# Altium project MIcrocontroller_Fit.PrjPcb
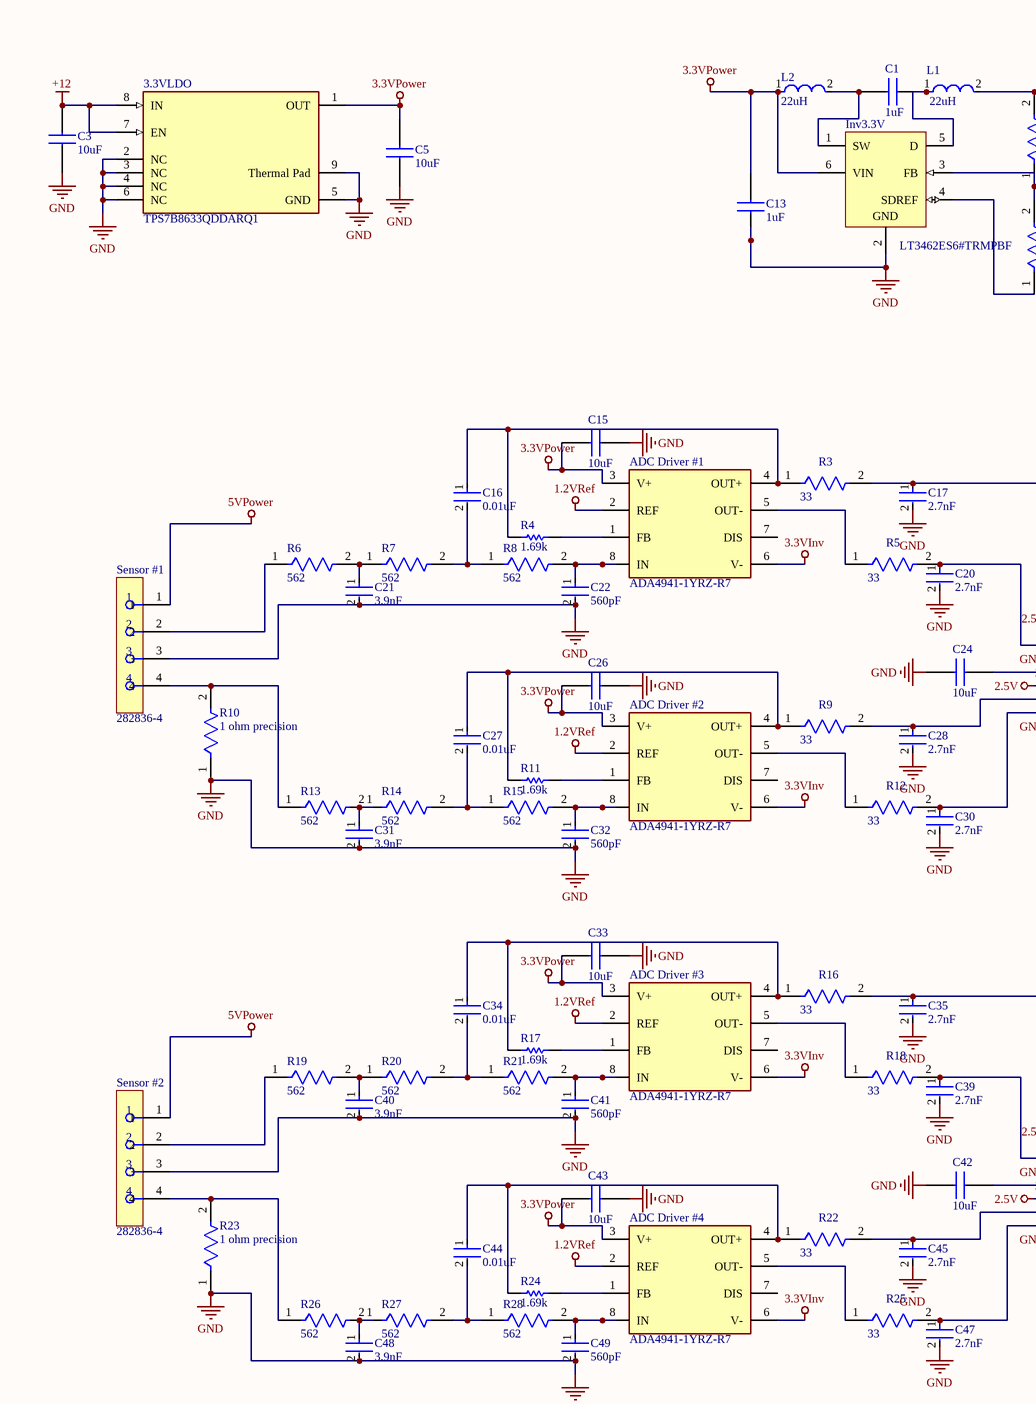
[diagram p0: Sheet1.SchDoc, top left]
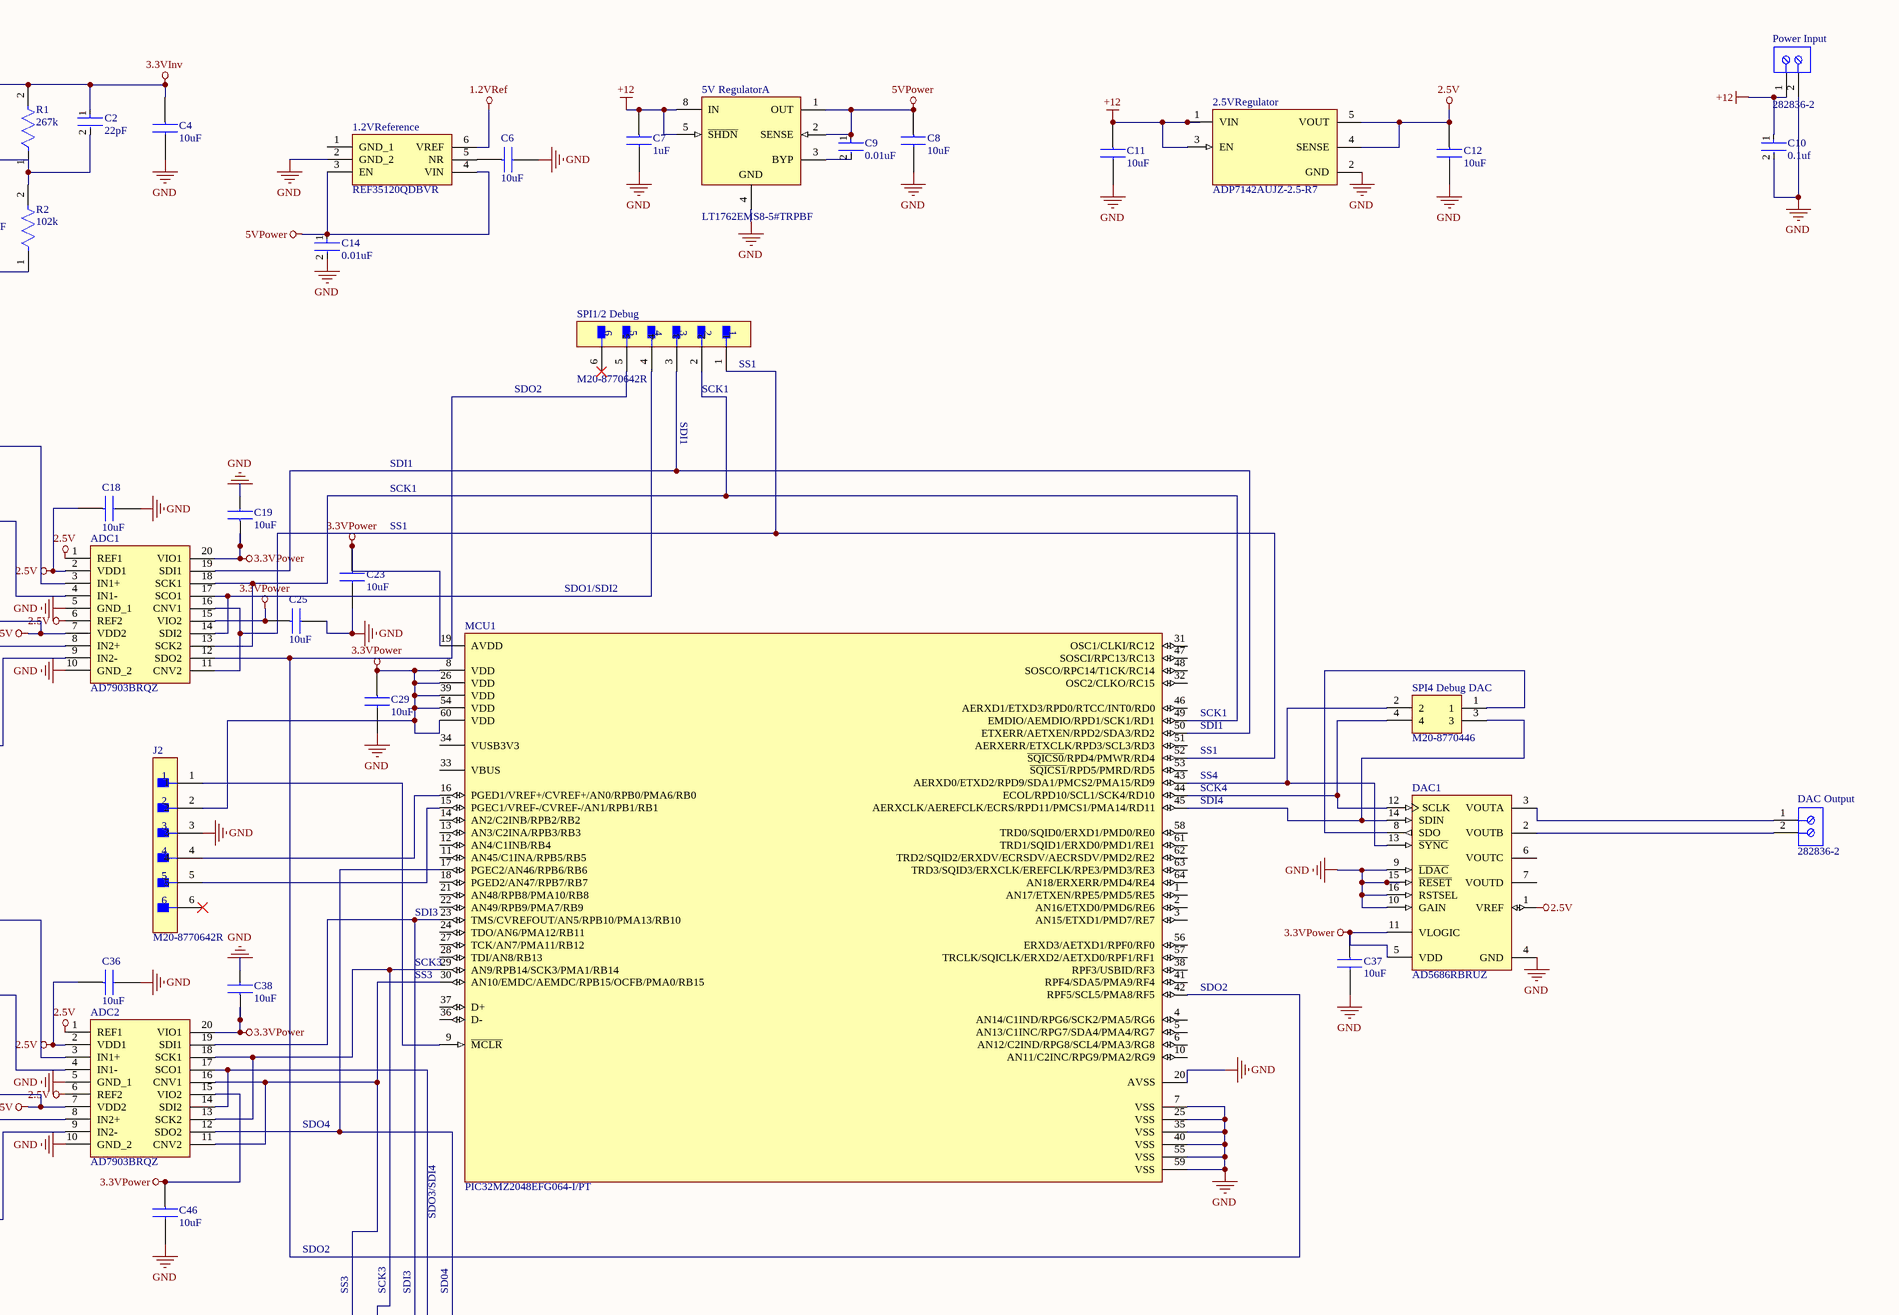
[diagram p1: Sheet1.SchDoc, top right]
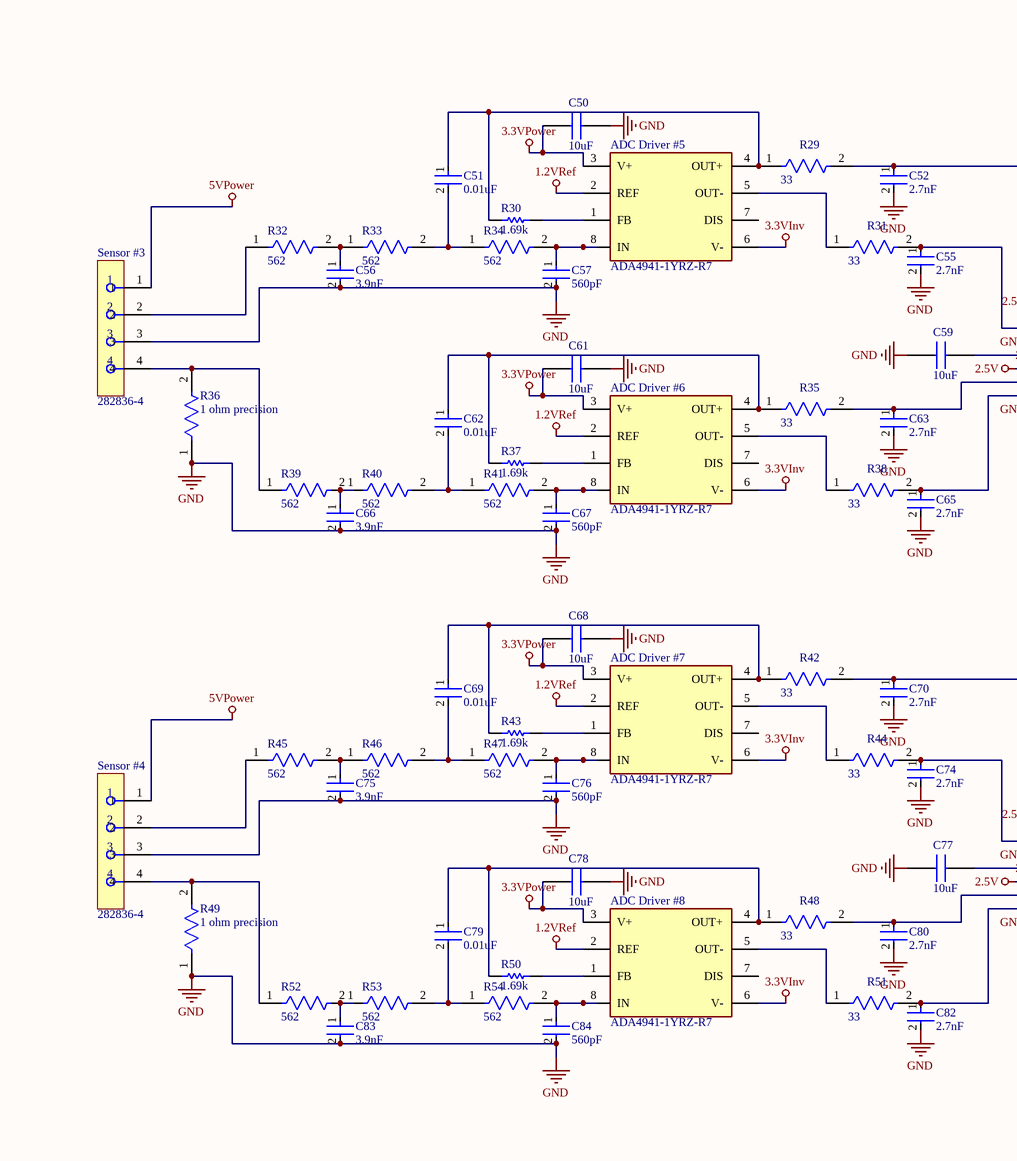
[diagram p2: Sheet1.SchDoc, bottom left]
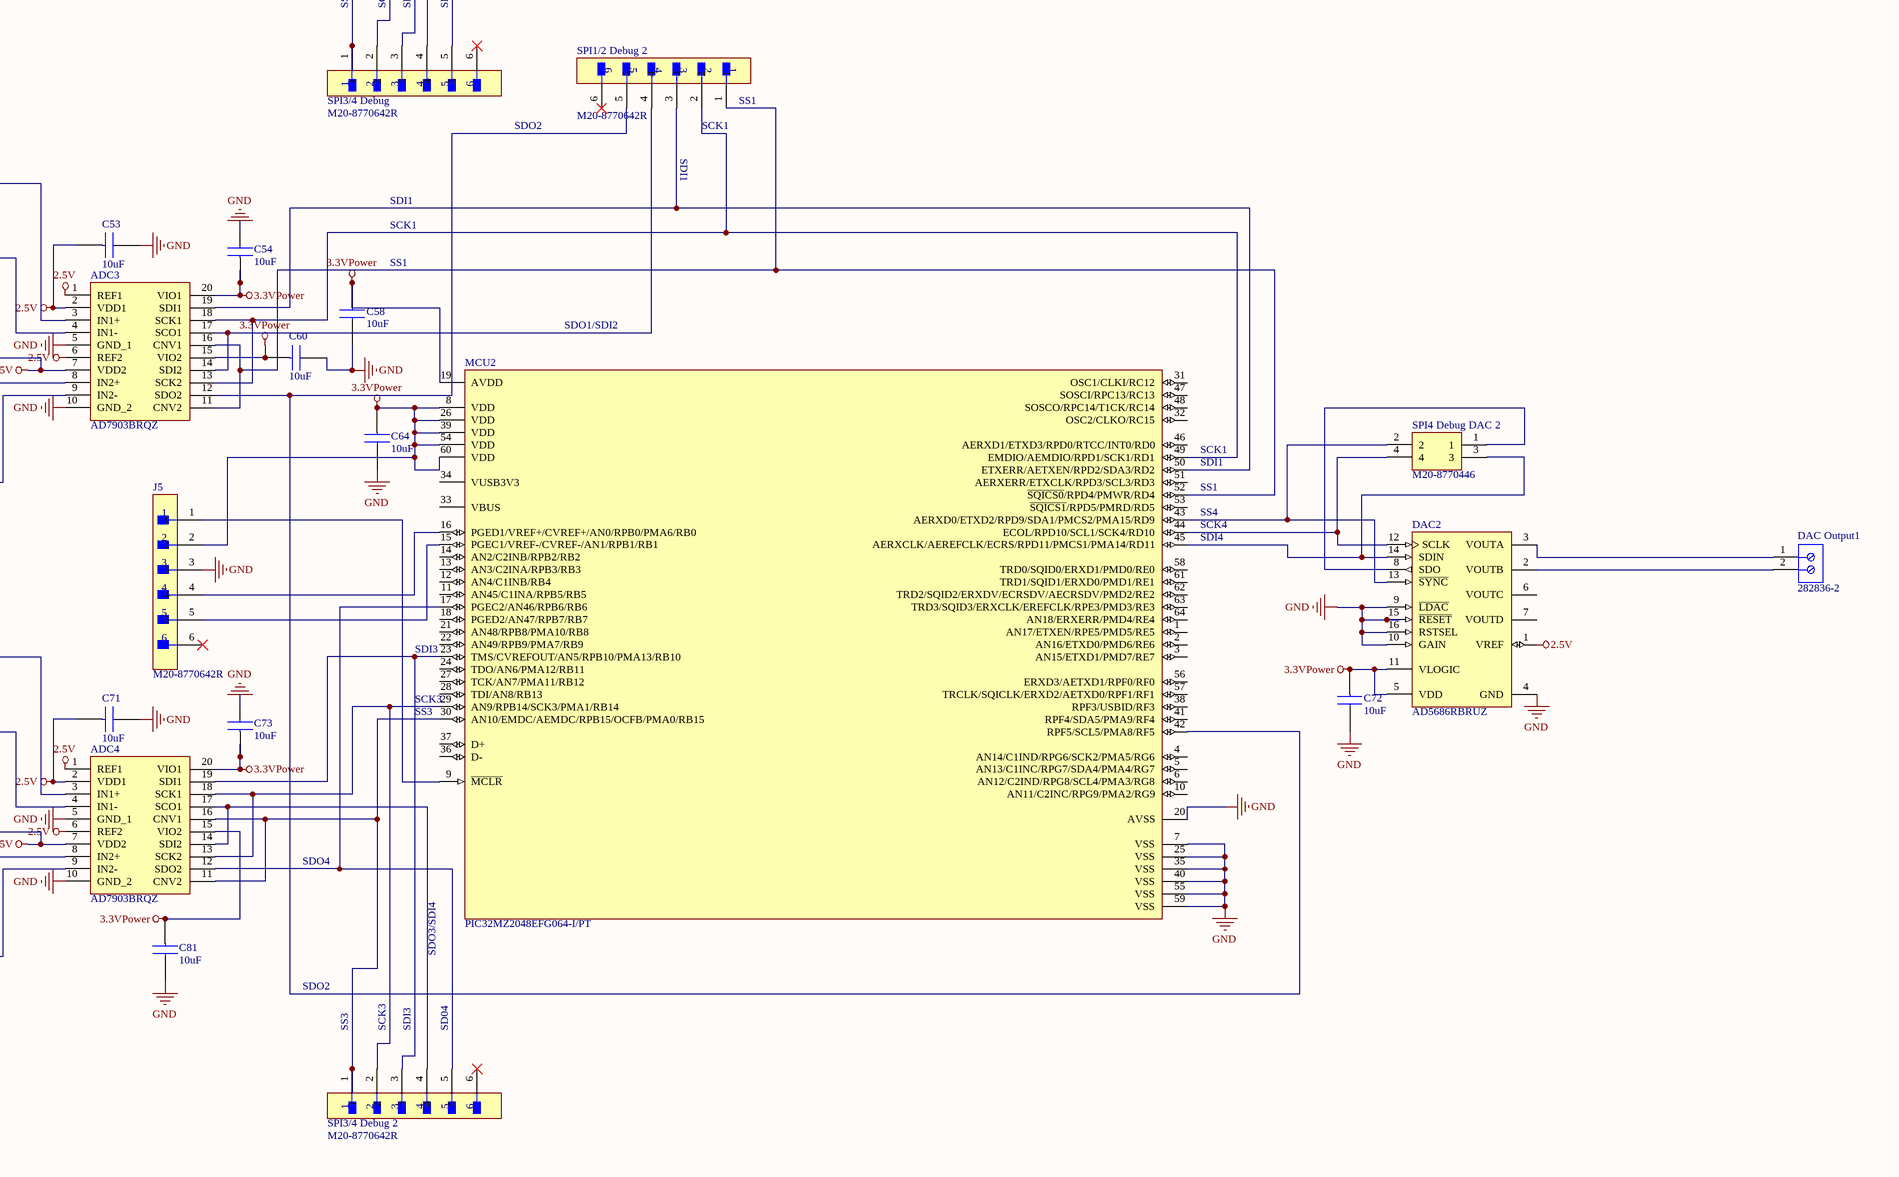
[diagram p3: Sheet1.SchDoc, bottom right]
1 sheet, 176 parts. Net scope: global (net labels, ports and power ports of the same name join across sheets).
Board file: PCB2.PcbDoc

## Sheet Sheet1.SchDoc
size 635 x 508 mm; SheetNumber: 1; SheetTotal: 1

### Parts
1.2VReference  REF35120QDBVR  [SOT95P280X145-6N]
2.5VRegulator  ADP7142AUJZ-2.5-R7  [FP-UJ-5-IPC_B]
3.3VLDO  TPS7B8633QDDARQ1  [FP-DDA0008B-MFG]
5V_Regulator  LT1762EMS8-5#TRPBF  [LT-MS8_L]  (part A of 2)
ADC1  AD7903BRQZ  [SOP64P600X175-20N]
ADC2  AD7903BRQZ  [RQ_20_ADI]
ADC3  AD7903BRQZ  [SOP64P600X175-20N]
ADC4  AD7903BRQZ  [SOP64P600X175-20N]
ADC_Driver_#1  ADA4941-1YRZ-R7  [FP-R-8-IPC_B]
ADC_Driver_#2  ADA4941-1YRZ-R7  [FP-R-8-IPC_B]
ADC_Driver_#3  ADA4941-1YRZ-R7  [FP-R-8-IPC_B]
ADC_Driver_#4  ADA4941-1YRZ-R7  [FP-R-8-IPC_B]
ADC_Driver_#5  ADA4941-1YRZ-R7  [FP-R-8-IPC_B]
ADC_Driver_#6  ADA4941-1YRZ-R7  [FP-R-8-IPC_B]
ADC_Driver_#7  ADA4941-1YRZ-R7  [FP-R-8-IPC_B]
ADC_Driver_#8  ADA4941-1YRZ-R7  [FP-R-8-IPC_B]
C1  1uF  [CAPC3216X178N]
C2  22pF  [FP-C1206C-EB-MFG]
C3  10uF  [CAPC3216X229N]
C4  10uF  [CAPC3216X229N]
C5  10uF  [CAPC3216X229N]
C6  10uF  [CAPC3216X229N]
C7  1uF  [CAPC3216X178N]
C8  10uF  [CAPC3216X229N]
C9  0.01uF  [FP-C0603C-CF-MFG]
C10  0.1uf  [FP-C0603C-CF-MFG]
C11  10uF  [CAPC3216X229N]
C12  10uF  [CAPC3216X229N]
C13  1uF  [CAPC3216X178N]
C14  0.01uF  [FP-C0603C-CF-MFG]
C15  10uF  [CAPC3216X229N]
C16  0.01uF  [FP-C0603C-CF-MFG]
C17  2.7nF  [FP-1206-L_3_2_0_2-W_1_6_0-IPC_A]
C18  10uF  [CAPC3216X229N]
C19  10uF  [CAPC3216X229N]
C20  2.7nF  [FP-1206-L_3_2_0_2-W_1_6_0-IPC_A]
C21  3.9nF  [FP-C1206C-EB-MFG]
C22  560pF  [FP-GCM31B-0_2-IPC_C]
C23  10uF  [CAPC3216X229N]
C24  10uF  [CAPC3216X229N]
C25  10uF  [CAPC3216X229N]
C26  10uF  [CAPC3216X229N]
C27  0.01uF  [FP-C0603C-CF-MFG]
C28  2.7nF  [FP-1206-L_3_2_0_2-W_1_6_0-IPC_A]
C29  10uF  [CAPC3216X229N]
C30  2.7nF  [FP-1206-L_3_2_0_2-W_1_6_0-IPC_A]
C31  3.9nF  [FP-C1206C-EB-MFG]
C32  560pF  [FP-GCM31B-0_2-IPC_C]
C33  10uF  [CAPC3216X229N]
C34  0.01uF  [FP-C0603C-CF-MFG]
C35  2.7nF  [FP-1206-L_3_2_0_2-W_1_6_0-IPC_A]
C36  10uF  [CAPC3216X229N]
C37  10uF  [CAPC3216X229N]
C38  10uF  [CAPC3216X229N]
C39  2.7nF  [FP-1206-L_3_2_0_2-W_1_6_0-IPC_A]
C40  3.9nF  [FP-C1206C-EB-MFG]
C41  560pF  [FP-GCM31B-0_2-IPC_C]
C42  10uF  [CAPC3216X229N]
C43  10uF  [CAPC3216X229N]
C44  0.01uF  [FP-C0603C-CF-MFG]
C45  2.7nF  [FP-1206-L_3_2_0_2-W_1_6_0-IPC_A]
C46  10uF  [CAPC3216X229N]
C47  2.7nF  [FP-1206-L_3_2_0_2-W_1_6_0-IPC_A]
C48  3.9nF  [FP-C1206C-EB-MFG]
C49  560pF  [FP-GCM31B-0_2-IPC_C]
C50  10uF  [CAPC3216X229N]
C51  0.01uF  [FP-C0603C-CF-MFG]
C52  2.7nF  [FP-1206-L_3_2_0_2-W_1_6_0-IPC_A]
C53  10uF  [CAPC3216X229N]
C54  10uF  [CAPC3216X229N]
C55  2.7nF  [FP-1206-L_3_2_0_2-W_1_6_0-IPC_A]
C56  3.9nF  [FP-C1206C-EB-MFG]
C57  560pF  [FP-GCM31B-0_2-IPC_C]
C58  10uF  [CAPC3216X229N]
C59  10uF  [CAPC3216X229N]
C60  10uF  [CAPC3216X229N]
C61  10uF  [CAPC3216X229N]
C62  0.01uF  [FP-C0603C-CF-MFG]
C63  2.7nF  [FP-1206-L_3_2_0_2-W_1_6_0-IPC_A]
C64  10uF  [CAPC3216X229N]
C65  2.7nF  [FP-1206-L_3_2_0_2-W_1_6_0-IPC_A]
C66  3.9nF  [FP-C1206C-EB-MFG]
C67  560pF  [FP-GCM31B-0_2-IPC_C]
C68  10uF  [CAPC3216X229N]
C69  0.01uF  [FP-C0603C-CF-MFG]
C70  2.7nF  [FP-1206-L_3_2_0_2-W_1_6_0-IPC_A]
C71  10uF  [CAPC3216X229N]
C72  10uF  [CAPC3216X229N]
C73  10uF  [CAPC3216X229N]
C74  2.7nF  [FP-1206-L_3_2_0_2-W_1_6_0-IPC_A]
C75  3.9nF  [FP-C1206C-EB-MFG]
C76  560pF  [FP-GCM31B-0_2-IPC_C]
C77  10uF  [CAPC3216X229N]
C78  10uF  [CAPC3216X229N]
C79  0.01uF  [FP-C0603C-CF-MFG]
C80  2.7nF  [FP-1206-L_3_2_0_2-W_1_6_0-IPC_A]
C81  10uF  [CAPC3216X229N]
C82  2.7nF  [FP-1206-L_3_2_0_2-W_1_6_0-IPC_A]
C83  3.9nF  [FP-C1206C-EB-MFG]
C84  560pF  [FP-GCM31B-0_2-IPC_C]
DAC1  AD5686RBRUZ  [RU-16_N]
DAC2  AD5686RBRUZ  [RU-16_N]
DAC_Output  282836-2  [TECO-282836-2_V]
DAC_Output1  282836-2  [TECO-282836-2_V]
Inv3.3V  LT3462ES6#TRMPBF  [LT-S6-6-TSOT-23_L]
J2  M20-8770642R  [FP-M20-8770642R-MFG]
J5  M20-8770642R  [FP-M20-8770642R-MFG]
L1  22uH  [FP-DEM4518C-MFG]
L2  22uH  [FP-DEM4518C-MFG]
MCU1  PIC32MZ2048EFG064-I/PT  [FP-C04-085-PT-IPC_C]
MCU2  PIC32MZ2048EFG064-I/PT  [FP-C04-085-PT-IPC_C]
Power_Input  282836-2  [TECO-282836-2_V]
R1  267k  [FP-RP731J-MFG]
R2  102k  [FP-RT0603-MFG]
R3  33  [FP-SR1206-MFG]
R4  1.69k  [RESC3216X60X45ML10T20]
R5  33  [FP-SR1206-MFG]
R6  562  [FP-RP732B-MFG]
R7  562  [FP-RP732B-MFG]
R8  562  [FP-RP732B-MFG]
R9  33  [FP-SR1206-MFG]
R10  1 ohm precision  [FP-AC0402-IPC_C]
R11  1.69k  [RESC3216X60X45ML10T20]
R12  33  [FP-SR1206-MFG]
R13  562  [FP-RP732B-MFG]
R14  562  [FP-RP732B-MFG]
R15  562  [FP-RP732B-MFG]
R16  33  [FP-SR1206-MFG]
R17  1.69k  [RESC3216X60X45ML10T20]
R18  33  [FP-SR1206-MFG]
R19  562  [FP-RP732B-MFG]
R20  562  [FP-RP732B-MFG]
R21  562  [FP-RP732B-MFG]
R22  33  [FP-SR1206-MFG]
R23  1 ohm precision  [FP-AC0402-IPC_C]
R24  1.69k  [RESC3216X60X45ML10T20]
R25  33  [FP-SR1206-MFG]
R26  562  [FP-RP732B-MFG]
R27  562  [FP-RP732B-MFG]
R28  562  [FP-RP732B-MFG]
R29  33  [FP-SR1206-MFG]
R30  1.69k  [RESC3216X60X45ML10T20]
R31  33  [FP-SR1206-MFG]
R32  562  [FP-RP732B-MFG]
R33  562  [FP-RP732B-MFG]
R34  562  [FP-RP732B-MFG]
R35  33  [FP-SR1206-MFG]
R36  1 ohm precision  [FP-AC0402-IPC_C]
R37  1.69k  [RESC3216X60X45ML10T20]
R38  33  [FP-SR1206-MFG]
R39  562  [FP-RP732B-MFG]
R40  562  [FP-RP732B-MFG]
R41  562  [FP-RP732B-MFG]
R42  33  [FP-SR1206-MFG]
R43  1.69k  [RESC3216X60X45ML10T20]
R44  33  [FP-SR1206-MFG]
R45  562  [FP-RP732B-MFG]
R46  562  [FP-RP732B-MFG]
R47  562  [FP-RP732B-MFG]
R48  33  [FP-SR1206-MFG]
R49  1 ohm precision  [FP-AC0402-IPC_C]
R50  1.69k  [RESC3216X60X45ML10T20]
R51  33  [FP-SR1206-MFG]
R52  562  [FP-RP732B-MFG]
R53  562  [FP-RP732B-MFG]
R54  562  [FP-RP732B-MFG]
Sensor_#1  282836-4  [FP-282836-4-MFG]
Sensor_#2  282836-4  [FP-282836-4-MFG]
Sensor_#3  282836-4  [FP-282836-4-MFG]
Sensor_#4  282836-4  [FP-282836-4-MFG]
SPI1/2_Debug  M20-8770642R  [FP-M20-8770642R-MFG]
SPI1/2_Debug_2  M20-8770642R  [FP-M20-8770642R-MFG]
SPI3/4_Debug  M20-8770642R  [FP-M20-8770642R-MFG]
SPI3/4_Debug_2  M20-8770642R  [FP-M20-8770642R-MFG]
SPI4_Debug_DAC  M20-8770446  [M208770446]
SPI4_Debug_DAC_2  M20-8770446  [M208770446]

### Nets
1.2VRef: 1.2VReference.6(VREF) ADC_Driver_#1.2(REF) ADC_Driver_#2.2(REF) ADC_Driver_#3.2(REF) ADC_Driver_#4.2(REF) ADC_Driver_#5.2(REF) ADC_Driver_#6.2(REF) ADC_Driver_#7.2(REF) ADC_Driver_#8.2(REF)
2.5V: 2.5VRegulator.4(SENSE) 2.5VRegulator.5(VOUT) ADC1.1(REF1) ADC1.2(VDD1) ADC1.6(REF2) ADC1.7(VDD2) ADC2.1(REF1) ADC2.2(VDD1) ADC2.6(REF2) ADC2.7(VDD2) ADC3.1(REF1) ADC3.2(VDD1) ADC3.6(REF2) ADC3.7(VDD2) ADC4.1(REF1) ADC4.2(VDD1) ADC4.6(REF2) ADC4.7(VDD2) C12.2 C18.2 C24.2 C36.2 C42.2 C53.2 C59.2 C71.2 C77.2 DAC1.1(VREF) DAC2.1(VREF)
3.3VInv: ADC_Driver_#1.6(V-) ADC_Driver_#2.6(V-) ADC_Driver_#3.6(V-) ADC_Driver_#4.6(V-) ADC_Driver_#5.6(V-) ADC_Driver_#6.6(V-) ADC_Driver_#7.6(V-) ADC_Driver_#8.6(V-) C2.1 C4.2 L1.2 R1.2
3.3VPower: 3.3VLDO.1(OUT) ADC1.15(VIO2) ADC1.20(VIO1) ADC2.15(VIO2) ADC2.20(VIO1) ADC3.15(VIO2) ADC3.20(VIO1) ADC4.15(VIO2) ADC4.20(VIO1) ADC_Driver_#1.3(V+) ADC_Driver_#2.3(V+) ADC_Driver_#3.3(V+) ADC_Driver_#4.3(V+) ADC_Driver_#5.3(V+) ADC_Driver_#6.3(V+) ADC_Driver_#7.3(V+) ADC_Driver_#8.3(V+) C5.2 C13.2 C15.2 C19.2 C23.2 C25.2 C26.2 C29.2 C33.2 C37.2 C38.2 C43.2 C46.2 C50.2 C54.2 C58.2 C60.2 C61.2 C64.2 C68.2 C72.2 C73.2 C78.2 C81.2 DAC1.5(VDD) DAC1.11(VLOGIC) DAC2.5(VDD) DAC2.11(VLOGIC) Inv3.3V.6(VIN) J2.2 J5.2 L2.1 MCU1.8(VDD) MCU1.19(AVDD) MCU1.26(VDD) MCU1.39(VDD) MCU1.54(VDD) MCU1.60(VDD) MCU2.8(VDD) MCU2.19(AVDD) MCU2.26(VDD) MCU2.39(VDD) MCU2.54(VDD) MCU2.60(VDD)
5VPower: 1.2VReference.3(EN) 1.2VReference.4(VIN) 5V_Regulator.1(OUT) 5V_Regulator.2(SENSE) C8.2 C9.1 C14.1 Sensor_#1.1 Sensor_#2.1 Sensor_#3.1 Sensor_#4.1
+12: 2.5VRegulator.1(VIN) 2.5VRegulator.3(EN) 3.3VLDO.7(EN) 3.3VLDO.8(IN) 5V_Regulator.5(~{SHDN}) 5V_Regulator.8(IN) C3.2 C7.2 C10.1 C11.2 Power_Input.1
GND: 1.2VReference.2(GND_2) 2.5VRegulator.2(GND) 3.3VLDO.2(NC) 3.3VLDO.3(NC) 3.3VLDO.4(NC) 3.3VLDO.5(GND) 3.3VLDO.6(NC) 3.3VLDO.9(Thermal_Pad) 5V_Regulator.4(GND) ADC1.5(GND_1) ADC1.10(GND_2) ADC2.5(GND_1) ADC2.10(GND_2) ADC3.5(GND_1) ADC3.10(GND_2) ADC4.5(GND_1) ADC4.10(GND_2) C3.1 C4.1 C5.1 C6.1 C7.1 C8.1 C10.2 C11.1 C12.1 C13.1 C14.2 C15.1 C17.2 C18.1 C19.1 C20.2 C21.2 C22.2 C23.1 C24.1 C25.1 C26.1 C28.2 C29.1 C30.2 C31.2 C32.2 C33.1 C35.2 C36.1 C37.1 C38.1 C39.2 C40.2 C41.2 C42.1 C43.1 C45.2 C46.1 C47.2 C48.2 C49.2 C50.1 C52.2 C53.1 C54.1 C55.2 C56.2 C57.2 C58.1 C59.1 C60.1 C61.1 C63.2 C64.1 C65.2 C66.2 C67.2 C68.1 C70.2 C71.1 C72.1 C73.1 C74.2 C75.2 C76.2 C77.1 C78.1 C80.2 C81.1 C82.2 C83.2 C84.2 DAC1.4(GND) DAC1.9(~{LDAC}) DAC1.10(GAIN) DAC1.15(~{RESET}) DAC1.16(RSTSEL) DAC2.4(GND) DAC2.9(~{LDAC}) DAC2.10(GAIN) DAC2.15(~{RESET}) DAC2.16(RSTSEL) Inv3.3V.2(GND) J2.3 J5.3 MCU1.7(VSS) MCU1.20(AVSS) MCU1.25(VSS) MCU1.35(VSS) MCU1.40(VSS) MCU1.55(VSS) MCU1.59(VSS) MCU2.7(VSS) MCU2.20(AVSS) MCU2.25(VSS) MCU2.35(VSS) MCU2.40(VSS) MCU2.55(VSS) MCU2.59(VSS) Power_Input.2 R10.1 R23.1 R36.1 R49.1 Sensor_#1.3 Sensor_#2.3 Sensor_#3.3 Sensor_#4.3
Net1.2VReference_5: 1.2VReference.5(NR) C6.2
Net5V_Regulator_3: 5V_Regulator.3(BYP) C9.2
NetADC1_3: ADC1.3(IN1+) C17.1 R3.2
NetADC1_4: ADC1.4(IN1-) C20.1 R5.2
NetADC1_8: ADC1.8(IN2+) C28.1 R9.2
NetADC1_9: ADC1.9(IN2-) C30.1 R12.2
NetADC1_11: ADC1.11(CNV2) ADC1.16(CNV1) MCU1.52(~{SQICS0}/RPD4/PMWR/RD4) SPI1/2_Debug.1
NetADC1_12: ADC1.12(SDO2) MCU1.42(RPF5/SCL5/PMA8/RF5) SPI1/2_Debug.5
NetADC1_13: ADC1.13(SCK2) ADC1.18(SCK1) MCU1.49(EMDIO/AEMDIO/RPD1/SCK1/RD1) SPI1/2_Debug.2
NetADC1_14: ADC1.14(SDI2) ADC1.17(SCO1) SPI1/2_Debug.4
NetADC1_19: ADC1.19(SDI1) MCU1.50(ETXERR/AETXEN/RPD2/SDA3/RD2) SPI1/2_Debug.3
NetADC2_3: ADC2.3(IN1+) C35.1 R16.2
NetADC2_4: ADC2.4(IN1-) C39.1 R18.2
NetADC2_8: ADC2.8(IN2+) C45.1 R22.2
NetADC2_9: ADC2.9(IN2-) C47.1 R25.2
NetADC2_11: ADC2.11(CNV2) ADC2.16(CNV1) MCU1.30(AN10/EMDC/AEMDC/RPB15/OCFB/PMA0/RB15) SPI3/4_Debug.1
NetADC2_12: ADC2.12(SDO2) MCU1.17(PGEC2/AN46/RPB6/RB6) SPI3/4_Debug.5
NetADC2_13: ADC2.13(SCK2) ADC2.18(SCK1) MCU1.29(AN9/RPB14/SCK3/PMA1/RB14) SPI3/4_Debug.2
NetADC2_14: ADC2.14(SDI2) ADC2.17(SCO1) SPI3/4_Debug.4
NetADC2_19: ADC2.19(SDI1) MCU1.23(TMS/CVREFOUT/AN5/RPB10/PMA13/RB10) SPI3/4_Debug.3
NetADC3_3: ADC3.3(IN1+) C52.1 R29.2
NetADC3_4: ADC3.4(IN1-) C55.1 R31.2
NetADC3_8: ADC3.8(IN2+) C63.1 R35.2
NetADC3_9: ADC3.9(IN2-) C65.1 R38.2
NetADC3_11: ADC3.11(CNV2) ADC3.16(CNV1) MCU2.52(~{SQICS0}/RPD4/PMWR/RD4) SPI1/2_Debug_2.1
NetADC3_12: ADC3.12(SDO2) MCU2.42(RPF5/SCL5/PMA8/RF5) SPI1/2_Debug_2.5
NetADC3_13: ADC3.13(SCK2) ADC3.18(SCK1) MCU2.49(EMDIO/AEMDIO/RPD1/SCK1/RD1) SPI1/2_Debug_2.2
NetADC3_14: ADC3.14(SDI2) ADC3.17(SCO1) SPI1/2_Debug_2.4
NetADC3_19: ADC3.19(SDI1) MCU2.50(ETXERR/AETXEN/RPD2/SDA3/RD2) SPI1/2_Debug_2.3
NetADC4_3: ADC4.3(IN1+) C70.1 R42.2
NetADC4_4: ADC4.4(IN1-) C74.1 R44.2
NetADC4_8: ADC4.8(IN2+) C80.1 R48.2
NetADC4_9: ADC4.9(IN2-) C82.1 R51.2
NetADC4_11: ADC4.11(CNV2) ADC4.16(CNV1) MCU2.30(AN10/EMDC/AEMDC/RPB15/OCFB/PMA0/RB15) SPI3/4_Debug_2.1
NetADC4_12: ADC4.12(SDO2) MCU2.17(PGEC2/AN46/RPB6/RB6) SPI3/4_Debug_2.5
NetADC4_13: ADC4.13(SCK2) ADC4.18(SCK1) MCU2.29(AN9/RPB14/SCK3/PMA1/RB14) SPI3/4_Debug_2.2
NetADC4_14: ADC4.14(SDI2) ADC4.17(SCO1) SPI3/4_Debug_2.4
NetADC4_19: ADC4.19(SDI1) MCU2.23(TMS/CVREFOUT/AN5/RPB10/PMA13/RB10) SPI3/4_Debug_2.3
NetADC_Driver_#1_1: ADC_Driver_#1.1(FB) R4.2
NetADC_Driver_#1_4: ADC_Driver_#1.4(OUT+) C16.1 R3.1 R4.1
NetADC_Driver_#1_5: ADC_Driver_#1.5(OUT-) R5.1
NetADC_Driver_#1_8: ADC_Driver_#1.8(IN) C22.1 R8.2
NetADC_Driver_#2_1: ADC_Driver_#2.1(FB) R11.2
NetADC_Driver_#2_4: ADC_Driver_#2.4(OUT+) C27.1 R9.1 R11.1
NetADC_Driver_#2_5: ADC_Driver_#2.5(OUT-) R12.1
NetADC_Driver_#2_8: ADC_Driver_#2.8(IN) C32.1 R15.2
NetADC_Driver_#3_1: ADC_Driver_#3.1(FB) R17.2
NetADC_Driver_#3_4: ADC_Driver_#3.4(OUT+) C34.1 R16.1 R17.1
NetADC_Driver_#3_5: ADC_Driver_#3.5(OUT-) R18.1
NetADC_Driver_#3_8: ADC_Driver_#3.8(IN) C41.1 R21.2
NetADC_Driver_#4_1: ADC_Driver_#4.1(FB) R24.2
NetADC_Driver_#4_4: ADC_Driver_#4.4(OUT+) C44.1 R22.1 R24.1
NetADC_Driver_#4_5: ADC_Driver_#4.5(OUT-) R25.1
NetADC_Driver_#4_8: ADC_Driver_#4.8(IN) C49.1 R28.2
NetADC_Driver_#5_1: ADC_Driver_#5.1(FB) R30.2
NetADC_Driver_#5_4: ADC_Driver_#5.4(OUT+) C51.1 R29.1 R30.1
NetADC_Driver_#5_5: ADC_Driver_#5.5(OUT-) R31.1
NetADC_Driver_#5_8: ADC_Driver_#5.8(IN) C57.1 R34.2
NetADC_Driver_#6_1: ADC_Driver_#6.1(FB) R37.2
NetADC_Driver_#6_4: ADC_Driver_#6.4(OUT+) C62.1 R35.1 R37.1
NetADC_Driver_#6_5: ADC_Driver_#6.5(OUT-) R38.1
NetADC_Driver_#6_8: ADC_Driver_#6.8(IN) C67.1 R41.2
NetADC_Driver_#7_1: ADC_Driver_#7.1(FB) R43.2
NetADC_Driver_#7_4: ADC_Driver_#7.4(OUT+) C69.1 R42.1 R43.1
NetADC_Driver_#7_5: ADC_Driver_#7.5(OUT-) R44.1
NetADC_Driver_#7_8: ADC_Driver_#7.8(IN) C76.1 R47.2
NetADC_Driver_#8_1: ADC_Driver_#8.1(FB) R50.2
NetADC_Driver_#8_4: ADC_Driver_#8.4(OUT+) C79.1 R48.1 R50.1
NetADC_Driver_#8_5: ADC_Driver_#8.5(OUT-) R51.1
NetADC_Driver_#8_8: ADC_Driver_#8.8(IN) C84.1 R54.2
NetC1_1: C1.1 Inv3.3V.1(SW) L2.2
NetC1_2: C1.2 Inv3.3V.5(D) L1.1
NetC2_2: C2.2 Inv3.3V.3(FB) R1.1 R2.2
NetC16_2: C16.2 R7.2 R8.1
NetC21_1: C21.1 R6.2 R7.1
NetC27_2: C27.2 R14.2 R15.1
NetC31_1: C31.1 R13.2 R14.1
NetC34_2: C34.2 R20.2 R21.1
NetC40_1: C40.1 R19.2 R20.1
NetC44_2: C44.2 R27.2 R28.1
NetC48_1: C48.1 R26.2 R27.1
NetC51_2: C51.2 R33.2 R34.1
NetC56_1: C56.1 R32.2 R33.1
NetC62_2: C62.2 R40.2 R41.1
NetC66_1: C66.1 R39.2 R40.1
NetC69_2: C69.2 R46.2 R47.1
NetC75_1: C75.1 R45.2 R46.1
NetC79_2: C79.2 R53.2 R54.1
NetC83_1: C83.1 R52.2 R53.1
NetDAC1_2: DAC1.2(VOUTB) DAC_Output.2
NetDAC1_3: DAC1.3(VOUTA) DAC_Output.1
NetDAC1_8: DAC1.8(SDO) SPI4_Debug_DAC.1
NetDAC1_12: DAC1.12(SCLK) MCU1.44(ECOL/RPD10/SCL1/SCK4/RD10) SPI4_Debug_DAC.4
NetDAC1_13: DAC1.13(~{SYNC}) MCU1.43(AERXD0/ETXD2/RPD9/SDA1/PMCS2/PMA15/RD9) SPI4_Debug_DAC.2
NetDAC1_14: DAC1.14(SDIN) MCU1.45(AERXCLK/AEREFCLK/ECRS/RPD11/PMCS1/PMA14/RD11) SPI4_Debug_DAC.3
NetDAC2_2: DAC2.2(VOUTB) DAC_Output1.2
NetDAC2_3: DAC2.3(VOUTA) DAC_Output1.1
NetDAC2_8: DAC2.8(SDO) SPI4_Debug_DAC_2.1
NetDAC2_12: DAC2.12(SCLK) MCU2.44(ECOL/RPD10/SCL1/SCK4/RD10) SPI4_Debug_DAC_2.4
NetDAC2_13: DAC2.13(~{SYNC}) MCU2.43(AERXD0/ETXD2/RPD9/SDA1/PMCS2/PMA15/RD9) SPI4_Debug_DAC_2.2
NetDAC2_14: DAC2.14(SDIN) MCU2.45(AERXCLK/AEREFCLK/ECRS/RPD11/PMCS1/PMA14/RD11) SPI4_Debug_DAC_2.3
NetInv3.3V_4: Inv3.3V.4(SDREF) R2.1
NetJ2_1: J2.1 MCU1.9(~{MCLR})
NetJ2_4: J2.4 MCU1.16(PGED1/VREF+/CVREF+/AN0/RPB0/PMA6/RB0)
NetJ2_5: J2.5 MCU1.15(PGEC1/VREF-/CVREF-/AN1/RPB1/RB1)
NetJ5_1: J5.1 MCU2.9(~{MCLR})
NetJ5_4: J5.4 MCU2.16(PGED1/VREF+/CVREF+/AN0/RPB0/PMA6/RB0)
NetJ5_5: J5.5 MCU2.15(PGEC1/VREF-/CVREF-/AN1/RPB1/RB1)
NetR6_1: R6.1 Sensor_#1.2
NetR10_2: R10.2 R13.1 Sensor_#1.4
NetR19_1: R19.1 Sensor_#2.2
NetR23_2: R23.2 R26.1 Sensor_#2.4
NetR32_1: R32.1 Sensor_#3.2
NetR36_2: R36.2 R39.1 Sensor_#3.4
NetR45_1: R45.1 Sensor_#4.2
NetR49_2: R49.2 R52.1 Sensor_#4.4

Not connected (* = marked no-connect by the designer): 1.2VReference 1(GND_1); ADC_Driver_#1 7(DIS); ADC_Driver_#2 7(DIS); ADC_Driver_#3 7(DIS); ADC_Driver_#4 7(DIS); ADC_Driver_#5 7(DIS); ADC_Driver_#6 7(DIS); ADC_Driver_#7 7(DIS); ADC_Driver_#8 7(DIS); DAC1 6(VOUTC) 7(VOUTD); DAC2 6(VOUTC) 7(VOUTD); J2 6*; J5 6*; MCU1 1(AN17/ETXEN/RPE5/PMD5/RE5) 2(AN16/ETXD0/PMD6/RE6) 3(AN15/ETXD1/PMD7/RE7) 4(AN14/C1IND/RPG6/SCK2/PMA5/RG6) 5(AN13/C1INC/RPG7/SDA4/PMA4/RG7) 6(AN12/C2IND/RPG8/SCL4/PMA3/RG8) 10(AN11/C2INC/RPG9/PMA2/RG9) 11(AN45/C1INA/RPB5/RB5) 12(AN4/C1INB/RB4) 13(AN3/C2INA/RPB3/RB3) 14(AN2/C2INB/RPB2/RB2) 18(PGED2/AN47/RPB7/RB7) 21(AN48/RPB8/PMA10/RB8) 22(AN49/RPB9/PMA7/RB9) 24(TDO/AN6/PMA12/RB11) 27(TCK/AN7/PMA11/RB12) 28(TDI/AN8/RB13) 31(OSC1/CLKI/RC12) 32(OSC2/CLKO/RC15) 33(VBUS) 34(VUSB3V3) 36(D-) 37(D+) 38(RPF3/USBID/RF3) 41(RPF4/SDA5/PMA9/RF4) 46(AERXD1/ETXD3/RPD0/RTCC/INT0/RD0) 47(SOSCI/RPC13/RC13) 48(SOSCO/RPC14/T1CK/RC14) 51(AERXERR/ETXCLK/RPD3/SCL3/RD3) 53(~{SQICS1}/RPD5/PMRD/RD5) 56(ERXD3/AETXD1/RPF0/RF0) 57(TRCLK/SQICLK/ERXD2/AETXD0/RPF1/RF1) 58(TRD0/SQID0/ERXD1/PMD0/RE0) 61(TRD1/SQID1/ERXD0/PMD1/RE1) 62(TRD2/SQID2/ERXDV/ECRSDV/AECRSDV/PMD2/RE2) 63(TRD3/SQID3/ERXCLK/EREFCLK/RPE3/PMD3/RE3) 64(AN18/ERXERR/PMD4/RE4); MCU2 1(AN17/ETXEN/RPE5/PMD5/RE5) 2(AN16/ETXD0/PMD6/RE6) 3(AN15/ETXD1/PMD7/RE7) 4(AN14/C1IND/RPG6/SCK2/PMA5/RG6) 5(AN13/C1INC/RPG7/SDA4/PMA4/RG7) 6(AN12/C2IND/RPG8/SCL4/PMA3/RG8) 10(AN11/C2INC/RPG9/PMA2/RG9) 11(AN45/C1INA/RPB5/RB5) 12(AN4/C1INB/RB4) 13(AN3/C2INA/RPB3/RB3) 14(AN2/C2INB/RPB2/RB2) 18(PGED2/AN47/RPB7/RB7) 21(AN48/RPB8/PMA10/RB8) 22(AN49/RPB9/PMA7/RB9) 24(TDO/AN6/PMA12/RB11) 27(TCK/AN7/PMA11/RB12) 28(TDI/AN8/RB13) 31(OSC1/CLKI/RC12) 32(OSC2/CLKO/RC15) 33(VBUS) 34(VUSB3V3) 36(D-) 37(D+) 38(RPF3/USBID/RF3) 41(RPF4/SDA5/PMA9/RF4) 46(AERXD1/ETXD3/RPD0/RTCC/INT0/RD0) 47(SOSCI/RPC13/RC13) 48(SOSCO/RPC14/T1CK/RC14) 51(AERXERR/ETXCLK/RPD3/SCL3/RD3) 53(~{SQICS1}/RPD5/PMRD/RD5) 56(ERXD3/AETXD1/RPF0/RF0) 57(TRCLK/SQICLK/ERXD2/AETXD0/RPF1/RF1) 58(TRD0/SQID0/ERXD1/PMD0/RE0) 61(TRD1/SQID1/ERXD0/PMD1/RE1) 62(TRD2/SQID2/ERXDV/ECRSDV/AECRSDV/PMD2/RE2) 63(TRD3/SQID3/ERXCLK/EREFCLK/RPE3/PMD3/RE3) 64(AN18/ERXERR/PMD4/RE4); SPI1/2_Debug 6*; SPI1/2_Debug_2 6*; SPI3/4_Debug 6*; SPI3/4_Debug_2 6*

### Notes on the sheet
- SDO2
- SDI1
- (near SPI1/2_Debug) SCK1
- (near SPI1/2_Debug) SS1
- SS1
- SCK1
- SDO1/SDI2
- (near MCU1) SCK1
- (near MCU1) SDI1
- (near MCU1) SCK4
- (near MCU1) SS4
- (near MCU1) SS1
- (near MCU1) SDI4
- (near MCU1) SDI3
- (near MCU1) SCK3
- (near MCU1) SS3
- (near MCU1) SDO2
- SDO4
- (near MCU1) SDO3/SDI4
- SS3
- SCK3
- SDI3
- SD04
- (near SPI1/2_Debug_2) SCK1
- (near SPI1/2_Debug_2) SS1
- (near MCU2) SCK1
- (near MCU2) SDI1
- (near MCU2) SS1
- (near MCU2) SCK4
- (near MCU2) SDI4
- (near MCU2) SS4
- (near MCU2) SDI3
- (near MCU2) SCK3
- (near MCU2) SS3
- (near MCU2) SDO3/SDI4

### Library data of the parts
1.2VReference = REF35120QDBVR: Voltage References 650-nA quiescent current, 12-ppm/C drift, ultra-low-power precision voltage reference; Manufacturer_Name: Texas Instruments; Geometry.Height: 1.45mm; Mouser Part Number: 595-REF35120QDBVR; Mouser Price/Stock: https://www.mouser.co.uk/ProductDetail/Texas-Instruments/REF35120QDBVR?qs=IPgv5n7u5QaqWPuhqB4rXA%3D%3D; Manufacturer_Part_Number: REF35120QDBVR; Datasheet Link: https://www.ti.com/lit/ds/symlink/ref35.pdf?HQS=dis-mous-null-mousermode-dsf-pf-null-wwe&ts=1691289769260&ref_url=https%253A%252F%252Fwww.mouser.kr%252F
2.5VRegulator = CMP-09138-000287-1: IC REG LIN 2.5V 200MA TSOT23-5; Max Supply Current: 320uA; Output Configuration: Positive; Number of Regulators: 1; Operating Supply Current: 180uA; Min Input Voltage: 2.7V; Dropout Voltage: 200mV; Output Type: Fixed; Power Supply Rejection Ratio (PSRR): 88dB; Min Current Limit: 250mA; Accuracy: 0.8%; Max Input Voltage: 40V; Input Bias Current: 1uA; Quiescent Current: 140uA; Output Current: 200mA; Case/Package: SOT-23-5; Polarity: Positive; Number of Outputs: 1; Min Operating Temperature: -40°C; Contact Plating: Gold; Max Output Current: 200mA; Packaging: Tape and Reel; Number of Pins: 5; Min Output Voltage: 2.5V; Mount: Surface Mount; Package Quantity: 3000; Series: -; Output Voltage: 2.5V; RoHS Compliant: Yes; Lead Free: Contains Lead; Max Operating Temperature: 125°C
3.3VLDO = CMP-00370-110297362-1: TPS7B8633QDDARQ1 Automotive 500-mA, 40-V, ultra-low-IQ, low-dropout (LDO) linear regulator with power good; Manufacturer Lifecycle Status: ACTIVE; NexarPartId: 110297362; Height: 1.7mm; Length: 4.89mm; Width: 3.9mm; Thickness: 1.48mm; Number of Pins: 8; Lifecycle Status: Production
5V_Regulator = CMP-0476-00706-1: 150 mA, Low Noise, LDO Micropower Regulator, 1.8 to 20 V Vin, 5 V Vout, 8-pin SOP (MS8-8), -40 to 125 degC, Pb-Free, Tape and Reel; Manufacturer: Linear Technology; PSRR(dB): 65; Vin Max(V): 20; Discrete Pass Element: no; Iout(mA): 150; Isupply(mA): 0.025; Shutdown Current(uA): 1; Output Voltage: 5 V; Dropout Voltage(V): 0.27; Vin Min(V): 1.8; PackageReference: MS8; ComponentLink1URL: http://www.linear.com/; PackageVersion: Rev. G, 05/2013; DatasheetVersion: Rev. A; RoHS: TRUE; Noise(uV): 20; ComponentLink3Description: Package Specification; PartNumber: LT1762EMS8-5#TRPBF; ComponentLink1Description: Manufacturer URL; Mounting Technology: Surface Mount; ComponentLink2Description: Datasheet; Packing: Tape and Reel; ComponentLink3URL: http://cds.linear.com/docs/en/packaging/05081660_G_MS8.pdf; PackageDescription: 8-Pin Plastic MSOP, Body 3 x 3 mm, Pitch 0.65 mm; ComponentLink2URL: http://cds.linear.com/docs/en/datasheet/1762fa.pdf; Number of Outputs: 1
ADC1-ADC4 = AD7903BRQZ: Analog Devices AD7903BRQZ, 16 bit Serial ADC, Dual Differential Input, 20-Pin QSOP; Geometry.Height: 1.75mm; Mouser Part Number: 584-AD7903BRQZ; Mouser Price/Stock: https://www.mouser.co.uk/ProductDetail/Analog-Devices/AD7903BRQZ?qs=8qEfIxKlfRm3RPIr8yiqwg%3D%3D; Manufacturer_Name: Analog Devices; Manufacturer_Part_Number: AD7903BRQZ; Datasheet Link: http://www.analog.com/media/en/technical-documentation/data-sheets/AD7903.pdf
ADC_Driver_#1-ADC_Driver_#8 = CMP-09114-000057-1: IC ADC DRIVER 8SOIC; Nominal Supply Current: 2.3mA; Unity Gain Bandwidth Product: 31MHz; Power Supply Rejection Ratio (PSRR): 87dB; Slew Rate: 22V/µs; Gain Bandwidth Product: 30MHz; Max Supply Voltage: 12V; Input Bias Current: 4.5uA; Number of Elements: 2; Settling Time: 300ns; Output Current: 25mA; Number of Channels: 1; Min Supply Voltage: 2.7V; Input Offset Voltage (Vos): 400uV; Common Mode Rejection Ratio: 84dB; Input Resistance: 24MR; Voltage Gain: 6.06dB; Packaging: Tape and Reel; RoHS Compliant: Yes; Max Operating Temperature: 125°C; Radiation Hardening: No; -3db Bandwidth: 30MHz; Case/Package: SOIC; Series: -; Package Quantity: 1000; Bandwidth: 30MHz; Supply Current: 2.3mA; Contact Plating: Tin; Max Input Voltage: 12V; Number of Pins: 8; Lead Free: Contains Lead; Mount: Surface Mount; Min Input Voltage: 2.7V; Output Current per Channel: 25mA; Operating Supply Current: 2.3mA; Min Operating Temperature: -40°C
C1 C7 C13 = KAF31GR72A105KL: Multilayer Ceramic Capacitors MLCC - SMD/SMT 100V 1uF X7R 1206 10% AEC-Q200 FLEXITERM; Manufacturer_Name: Kyocera AVX; Geometry.Height: 1.78mm; Mouser Part Number: 581-KAF31GR72A105KL; Mouser Price/Stock: https://www.mouser.co.uk/ProductDetail/KYOCERA-AVX/KAF31GR72A105KL?qs=Jm2GQyTW%2FbirKGVNOlRzqw%3D%3D; Manufacturer_Part_Number: KAF31GR72A105KL; Datasheet Link: *
C2 = CMP-1037-00978-2: 1206 22pF Ceramic Multilayer Capacitor; 50VDC; 125degC; C0G Dielec; +/-5% SMD; Manufacturer Part Number: C1206C220J5GACTU; Manufacturer: KEMET; Automotive Grade: Grade 0; Temperature Coefficient: 15%; Tolerance: 0.05; Voltage Rating: 50 V; Height: 0.88mm; Mouser Description: 1206 22pF Ceramic Multilayer Capacitor; 50VDC; 125degC; C0G Dielec; +/-5% SMD; Ipc Land Pattern Name: CAPC320160X78; Temperature Range High: +150°C; Automotive: Yes; Device Class L3: Ceramic Capacitors; ComponentLink2Description: Datasheet; Temperature: -55°C to +150°C; Lead Free: Yes; Category: Cap; Device Class L2: Capacitors; Device Class L1: Passive Components; Value: 22 pF; Capacitance: 22 pF; Digikey Description: 1206 22pF Ceramic Multilayer Capacitor; 50VDC; 125degC; C0G Dielec; +/-5% SMD; Octopart: https://octopart.com/c1206c220j5gactu-kemet-131912; Material: Ceramic; Temperature Characteristic: C0G; Package: C1206C-EB; RoHS: TRUE; ComponentLink2URL: https://content.kemet.com/datasheets/KEM_C1007_X8R_ULTRA_150C_SMD.pdf; Temperature Range Low: -55°C
C3-C6 C8 C11 C12 C15 C18 C19 C23-C26 C29 C33 C36-C38 C42 C43 C46 C50 C53 C54 C58-C61 C64 C68 C71-C73 C77 C78 C81 = 1206DD106MAT2A: Multilayer Ceramic Capacitors MLCC - SMD/SMT 35V 10uF X5R 1206 20%; Manufacturer_Name: Kyocera AVX; Geometry.Height: 2.29mm; Mouser Part Number: 581-1206DD106MAT2A; Mouser Price/Stock: https://www.mouser.co.uk/ProductDetail/KYOCERA-AVX/1206DD106MAT2A?qs=lhAPX%252BE7qEaaGz%2FHFoBa1A%3D%3D; Manufacturer_Part_Number: 1206DD106MAT2A; Datasheet Link: *
C9 C10 C14 C16 C27 C34 C44 C51 C62 C69 C79 = CMP-2006-03061-2: CAP CER 0.1UF 50V X7R 0603; Manufacturer: KEMET; Manufacturer Part Number: C0603C104K5RACTU; Tolerance: 0.1; Temperature Coefficient: 30ppm/°C; Material: Ceramic; Automotive Grade: Grade 1; Value: 0.10 μF; Temperature: -55°C to +125°C; RoHS: TRUE; Temperature Range High: +125°C; Lead Free: Yes; Octopart: https://octopart.com/c0603c104k5ractu-kemet-139244; Digikey Description: CAP CER 0.1UF 50V X7R 0603; Category: Cap; Package: C0603C-CF; ComponentLink2Description: Datasheet; Temperature Range Low: -55°C; Device Class L1: Passive Components; Voltage Rating: 50 V; Automotive: Yes; Device Class L3: Ceramic Capacitors; ComponentLink2URL: https://api.kemet.com/component-edge/download/datasheet/C0603C100J5GACAUTO.pdf; Capacitance: 0.10 μF; Device Class L2: Capacitors; Temperature Characteristic: X7R; Height: 0.87mm
C17 C20 C28 C30 C35 C39 C45 C47 C52 C55 C63 C65 C70 C74 C80 C82 = CMP-04427-005956-1: General Purpose Ceramic Capacitor, 1206, 2.7nF, 2%, NP0, 30ppm/°C, 50V; Dielectric: C0G; Depth: 1.6mm; Length: 3.2mm; Mount: Surface Mount; Construction: Flat; Width: 0.063inch; Radiation Hardening: No; Case Code (Metric): 3216; Termination: SMD/SMT; Height: 0.5mm; Capacitance: 2.7nF; Case Code (Imperial): 1206; RoHS Compliant: Yes; Tolerance: 2%; Voltage Rating (DC): 50V; Package Quantity: 2000; Min Operating Temperature: -55°C; Packaging: Tape and Reel; Case/Package: 1206; Thickness: 0.05inch; Voltage Rating: 50V; Max Operating Temperature: 125°C
C21 C31 C40 C48 C56 C66 C75 C83 = CMP-1037-03025-3: CAP CER 3900PF 50V 1% NP0 1206; Manufacturer Part Number: C1206C392F5GACTU; Manufacturer: KEMET; Capacitance: 3,900 pF; Temperature Characteristic: C0G; Material: Ceramic; Temperature Coefficient: 15%; Automotive Grade: Grade 0; Value: 3,900 pF; Tolerance: 0.01; Temperature Range Low: -55°C; ComponentLink2Description: Datasheet; Octopart: https://octopart.com/c1206c392f5gactu-kemet-12595535; ComponentLink2URL: https://content.kemet.com/datasheets/KEM_C1007_X8R_ULTRA_150C_SMD.pdf; Temperature Range High: +150°C; Package: C1206C-EB; Device Class L3: Ceramic Capacitors; Category: Cap; Digikey Description: CAP CER 3900PF 50V 1% NP0 1206; Device Class L2: Capacitors; Ipc Land Pattern Name: CAPC320160X78; Voltage Rating: 50 V; Device Class L1: Passive Components; Height: 0.88mm; Temperature: -55°C to +150°C; Mouser Description: Multilayer Ceramic Capacitors MLCC - SMD/SMT 50volts 3900pF C0G 1%; Automotive: Yes; RoHS: TRUE; Lead Free: Yes
C22 C32 C41 C49 C57 C67 C76 C84 = CMP-06035-046423-1: Ceramic Capacitor for Automotive 560pF ±1% 1kVDC C0G 1206 Embossed T/R
DAC1 DAC2 = CMP-0318-01673-2: Quad 16-Bit nanoDAC+ with SPI Interface and 2 ppm/degC On-Chip Reference, -40 to +105 degC, RU-16, Pb-Free, Tube; Manufacturer: Analog Devices; Resolution (Bits): 16; Single Supply: Yes; # DAC Outputs: 4; Max V+: 5.5V; Settling Time: 5Âµs; ComponentLink4Description: Product URL; Generic Part Number: AD5686R; PackageDescription: 16-Lead Thin Shrink Small Outline Package [TSSOP]; ComponentLink2URL: http://www.analog.com/static/imported-files/data_sheets/AD5686R_AD5685R_AD5684R.pdf; PackageReference: RU-16; Mounting Technology: Surface Mount; DatasheetVersion: Rev.0; ComponentLink3Description: Package Specification; RoHS: Y; PartNumber: AD5686RBRUZ; PackageVersion: Nov-2002; Code_JEDEC: MO-153-AB; ComponentLink4URL: http://www.analog.com/en/digital-to-analog-converters/da-converters/ad5686r/products/product.html; ComponentLink3URL: http://www.analog.com/static/imported-files/packages/36244347913743854010197452789RU16.pdf; RevisionNote: Component URL fixed; Packing: Tube; ComponentLink1Description: Manufacturer URL; ComponentLink1URL: http://www.analog.com/en/index.html; ComponentLink2Description: Datasheet
DAC_Output DAC_Output1 Power_Input = CMP-1684-00017-1: Female Header, Pitch 5 mm, 1 x 2 Position, Height 10 mm, Tail Length 3.5 mm, Rohs, Bulk; Manufacturer: TE Connectivity; Wire Gauge: 16-30AWG; Product Training Modules: Wire-to-BoardEurostyleTerminalBlocks; Clamp Material - Plating: Brass-NickelPlated; Voltage: 300V; Mating Orientation: HorizontalwithBoard; Current: 13.5A; Pitch: 0.197"(5.00mm); Screw Thread: M3; 3D Model: 282836-2.pdf; Other Names: 5ULV-02B / A98076; Dynamic Catalog: BuchananSeries; Number of Levels: 1; Torque - Screw: 0.68Nm(6Lb-In); Featured Product: EurostyleTerminalBlockConnectors; Positions Per Level: 2; Wire Termination: Screw-RisingCageClamp; Datasheet URL: http://www.te.com.cn/commerce/DocumentDelivery/DDEController?Action=showdoc&DocId=Catalog+Section%7F1308389_EUROSTYLE_TERMINAL_BLOCKS%7F0607%7Fpdf%7FEnglish%7FENG_CS_1308389_EUROSTYLE_TERMINAL_BLOCKS_0607.pdf%7F282836-2; Color: Green; Family: TerminalBlocks-WiretoBoard; RoHS Information: 282836-2StatementofCompliance; Standard Package: 300; Contact Material - Plating: Brass-TinPlated; Manufacturer URL: http://www.te.com; Housing Material: Polyamide(PA66),Nylon6/6; Features: Interlocking(Side); Package Description: Female Header, Pitch 5 mm, 1 x 2 Position, Height 10 mm, Tail Length 3.5 mm; Mounting Type: ThroughHole; Package Reference: THD; Packaging: Bulk; Series: Buchanan; Category: Connectors,Interconnects; Screw Material - Plating: Brass-NickelPlated
Inv3.3V = CMP-0491-01714-1: Inverting 1.2 MHz DC/DC Converter with Integrated Schottky MAX, 6-pin SOT23 (S6-6), -40 to 85 degC, Pb-Free, Mini Tape and Reel; Manufacturer: Linear Technology; Number of Outputs: 1; ComponentLink2Description: Datasheet; Mounting Technology: Surface Mount; ComponentLink3URL: http://cds.linear.com/docs/en/packaging/SOT_6_05-08-1636.pdf; Packing: Mini Tape and Reel; ComponentLink2URL: http://cds.linear.com/docs/en/datasheet/3462af.pdf; ComponentLink3Description: Package Specification; PackageReference: S6-6; Code_JEDEC: MO-193; PackageVersion: Jun-10; ComponentLink1Description: Manufacturer URL; PackageDescription: 6-Pin Plastic TSOT-23, Body 2.9 x 1.63 mm, Pitch 0.95 mm; ComponentLink1URL: http://www.linear.com/; RoHS: TRUE; PartNumber: LT3462ES6#TRMPBF
J2 J5 SPI1/2_Debug SPI1/2_Debug_2 SPI3/4_Debug SPI3/4_Debug_2 = CMP-15831-000020-1: CONN HEADER SMD 6POS 2.54MM; Gender: Male; Contact Resistance: 30mR; Max Current Rating: 3A; Number of Contacts: 6; Depth: 2.54mm; Termination: Solder; Packaging: Tape and Reel; Number of Rows: 1; Housing Color: Black; Length: 15.24mm; Contact Plating: Gold; Min Operating Temperature: -40°C; Case/Package: SIL; Max Operating Temperature: 105°C; Housing Material: Nylon; Pitch: 2.54mm; Contact Material: Brass; Orientation: Straight
L1 L2 = CMP-06042-016273-1: FIXED IND; Current Rating: 1A; DC Resistance (DCR): 306mR; Saturation Current: 910mA; Shielding: Shielded; Core Material: Ferrite; Test Frequency: 100kHz; Tolerance: 20%; Length: 0.185inch; Height - Seated (Max): 0.071inch; Packaging: Tape and Reel; Case/Package: Nonstandard; Resistor Type: Wirewound; Mount: Surface Mount; Width: 0.177inch; Min Operating Temperature: -40°C; RoHS Compliant: Yes; Inductance: 22uH; Max Operating Temperature: 85°C
MCU1 MCU2 = CMP-06276-000703-1: IC MCU 32BIT 2MB FLASH 64TQFP; Peripherals: Brown-out Detect/Reset; Frequency: 200MHz; Oscillator Type: Internal; Interface: I2C; Number of I/Os: 46; RoHS Compliant: Yes; Packaging: Tray; Series: PIC® 32MZ; Memory Type: FLASH; Case/Package: TQFP; Max Operating Temperature: 85°C; Min Operating Temperature: -40°C; Mount: Surface Mount; Memory Size: 2MB
R1 = CMP-03211-009755-1: TE CONNECTIVITY / HOLSWORTHY SMD Chip Resistor, Thin Film, 267KΩ, 50 V, 0603 [1608 Metric], 100 mW, 0.1% , RP73 Series; Manufacturer Part Number: RP73D1J267KBTDG; Voltage Rating: 75V; Power Rating: 0.1W; Temperature Coefficient: 15ppm/°C; Temperature: -55°C to +105°C; RoHS: TRUE; Temperature Range High: +105°C; Octopart: https://octopart.com/rp73d1j267kbtdg-te+connectivity-42631794; Lead Free: Yes; Height: 0.55mm; Manufacturer: TE Connectivity; Ipc Land Pattern Name: RESC15580X45; Series: RP73; Category: Res; Resistance: 267KΩ; Device Class L3: Chip SMD Resistors; packaging: cut tape; Tolerance: 0.1%; Value: 267KΩ; ComponentLink2Description: Datasheet; Device Class L2: Resistors; Package: RP731J; Automotive: No; Device Class L1: Passive Components; Temperature Range Low: -55°C; Composition: Thin Film; ComponentLink2URL: https://www.te.com/commerce/DocumentDelivery/DDEController?Action=srchrtrv&DocNm=1773272&DocType=DS&DocLang=English; octopart_url: https://octopart.com/rp73d1j267kbtdg-te+connectivity-42631794
R2 = CMP-03412-022171-1: RES SMD 102K OHM 0.5% 1/10W 0603; Manufacturer Part Number: RT0603DRD07102KL; Manufacturer: Yageo; Tolerance: 0.005; Voltage Rating: 75V; Resistance: 102KΩ; Temperature Coefficient: 25 ppm/°C; Value: 102KΩ; Power Rating: 0.1W; Temperature Range Low: -55°C; Series: RT; Package: RT0603; Lead Free: Yes; ComponentLink2Description: Datasheet; Device Class L2: Resistors; Temperature Range High: +155°C; Device Class L1: Passive Components; Category: Res; Temperature: -55°C to +155°C; Ipc Land Pattern Name: RESC16080X45; Height: 0.55mm; Composition: Thin Film; Footprint Url: http://www.yageo.com/exep/pages/download/literatures/PYu-R_Mount_10.pdf; ComponentLink2URL: http://www.yageo.com/documents/recent/PYu-RT_1-to-0.01_RoHS_L_9.pdf; Device Class L3: Chip SMD Resistors; Automotive: No; Digikey Description: RES SMD 102K OHM 0.5% 1/10W 0603; RoHS: TRUE; Octopart: https://octopart.com/rt0603drd07102kl-yageo-1167904
R3 R5 R9 R12 R16 R18 R22 R25 R29 R31 R35 R38 R42 R44 R48 R51 = CMP-03412-019710-1: RES 33 OHM 1% 1/2W 1206; Manufacturer: Yageo; Manufacturer Part Number: SR1206FR-7W33RL; Resistance: 33Ω; Value: 33Ω; Voltage Rating: 200V; Power Rating: 0.5W; Automotive Grade: Grade 0; Tolerance: 0.01; Automotive: Yes; Device Class L2: Resistors; Device Class L1: Passive Components; RoHS: TRUE; Temperature Range Low: -55°C; Height: 0.65mm; Ipc Land Pattern Name: RESC310160X55; Series: SR; Temperature Range High: +155°C; Package: SR1206; Device Class L3: Chip SMD Resistors; ComponentLink2URL: http://www.yageo.com/documents/recent/PYu-SR_D_F%20tol_RoHS_L_3.pdf; Temperature: -55°C to +155°C; Composition: Thick Film; ComponentLink2Description: Datasheet; Lead Free: Yes; Footprint Url: http://www.yageo.com/exep/pages/download/literatures/PYu-R_Mount_10.pdf; Octopart: https://octopart.com/sr1206fr-7w33rl-yageo-91137161; Digikey Description: RES 33 OHM 1% 1/2W 1206; Category: Res
R4 R11 R17 R24 R30 R37 R43 R50 = CMP-2003-01897-1: Part Number: CRCW12061K69FKEA; Manufacturer: Vishay Dale
R6-R8 R13-R15 R19-R21 R26-R28 R32-R34 R39-R41 R45-R47 R52-R54 = CMP-03211-001648-1: Res Thin Film 1206 562Ω 0.1% 0.25W 15ppm/°C Molded SMD; Manufacturer: TE Connectivity; Manufacturer Part Number: RP73D2B562RBTG; Voltage Rating: 200V; Temperature Coefficient: 15ppm/°C; RoHS: TRUE; Tolerance: 0.1%; Package: RP732B; octopart_url: https://octopart.com/rp73d2b562rbtg-te+connectivity-42012201; Lead Free: Yes; Height: 0.65mm; Category: Res; packaging: 250 cut tape length; Ipc Land Pattern Name: RESC305155X55; Value: 562Ω; Device Class L1: Passive Components; Device Class L3: Chip SMD Resistors; Series: RP73; Device Class L2: Resistors; Temperature Range Low: -55°C; ComponentLink2URL: https://www.te.com/commerce/DocumentDelivery/DDEController?Action=showdoc&DocId=Data+Sheet%7F1773272%7FL%7Fpdf%7FEnglish%7FENG_DS_1773272_L.pdf%7F8-1879255-6; Octopart: https://octopart.com/rp73d2b562rbtg-te+connectivity-42012201; Power Rating: 0.25W; Resistance: 562Ω; Automotive: No; ComponentLink2Description: Datasheet; Temperature Range High: 155°C; Temperature: -55°C to 155°C; Composition: Thin Film
R10 R23 R36 R49 = CMP-03412-040887-1: RES 1Ω ±0.5% 0.063W 0402
Sensor_#1-Sensor_#4 = CMP-03790-46505329-1: 282836-4 Connector, Terminal Block; Wire Receptacle; 4 Pos.; 16-30 AWG; 0.197 in. CL; Sid; Manufacturer Lifecycle Status: ACTIVE; Number of Contacts: 4; Max Supply Voltage (AC): 300V; Wire Gauge (Min): 30AWG; Max Current Rating: 13.5A; Approvals: UL; Number of Levels: 1; Thread Size: M3; Connector System: Wire-to-Board; Voltage Rating (DC): 250V; Pitch: 5mm; Plating: Brass; Tail Length: 3.5mm; Housing Color: Green; Number of Rows: 1; REACH SVHC: Unknown; Lead Pitch: 5mm; Depth: 8.2mm; Lead Free: Lead Free; Mount: Through Hole; Contact Plating: Tin; Housing Material: Polyamide; ELV: Compliant; Radiation Hardening: No; RoHS: Compliant; Number of Circuits: 4; Voltage Rating: 300V; Contact Material: Brass; NexarPartId: 46505329; Current Rating: 13.5A; Max Voltage Rating (AC): 300V; Orientation: Straight; Number of Positions: 4; Lifecycle Status: Production; Operating Supply Voltage: 300V; Connector Type: Receptacle; Number of Positions Per Level: 4; Flammability Rating: UL94 V-0; Packaging: Bulk; Termination: Screw, Solder; Wire Gauge (Max): 30AWG; Number of Poles: 4; Width: 10mm; Voltage Rating (AC): 250V; Length: 20mm; Current: 13.5A; Voltage: 300V; Color: Green
SPI4_Debug_DAC SPI4_Debug_DAC_2 = M20-8770446: 2.54mm (0.1") Pitch SIL SMT Pin Header, tin, 4 contacts; Manufacturer_Name: Harwin; Geometry.Height: 10.01mm; Mouser Part Number: 855-M20-8770446; Mouser Price/Stock: https://www.mouser.co.uk/ProductDetail/Harwin/M20-8770446?qs=ulE8k0yEMYayCK2sgTwMGg%3D%3D; Manufacturer_Part_Number: M20-8770446; Datasheet Link: https://cdn.harwin.com/pdfs/M20-877.pdf